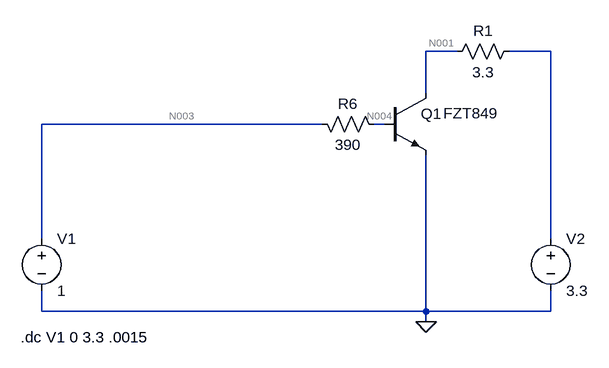
[diagram p0: schematic PLR5010D-Spice.asc]
PLR5010D-Spice.asc, the LTspice schematic file:
Version 4
SHEET 1 1044 680
WIRE 320 -160 272 -160
WIRE 464 -160 400 -160
WIRE 272 -96 272 -160
WIRE 112 -48 -320 -48
WIRE 208 -48 192 -48
WIRE -320 128 -320 -48
WIRE 464 128 464 -160
WIRE -320 240 -320 208
WIRE 272 240 272 0
WIRE 272 240 -320 240
WIRE 464 240 464 208
WIRE 464 240 272 240
WIRE 272 256 272 240
FLAG 272 256 0
SYMBOL voltage 464 112 R0
WINDOW 123 0 0 Left 2
WINDOW 39 0 0 Left 2
SYMATTR InstName V2
SYMATTR Value 3.3
SYMBOL res 416 -176 R90
WINDOW 0 0 56 VBottom 2
WINDOW 3 32 56 VTop 2
SYMATTR InstName R1
SYMATTR Value 3.3
SYMBOL npn 208 -96 R0
WINDOW 3 91 31 Left 2
SYMATTR Value FZT849
SYMATTR InstName Q1
SYMBOL voltage -320 112 R0
WINDOW 123 0 0 Left 2
WINDOW 39 0 0 Left 2
SYMATTR InstName V1
SYMATTR Value 1
SYMBOL res 96 -64 M90
WINDOW 0 0 56 VBottom 2
WINDOW 3 32 56 VTop 2
SYMATTR InstName R6
SYMATTR Value 390
TEXT -352 280 Left 2 !.dc V1 0 3.3 .0015

The netlist it stands for:
* PLR5010D-Spice.asc
V2 N002 0 3.3
R1 N002 N001 3.3
Q1 N001 N004 0 0 FZT849
V1 N003 0 1
R6 N003 N004 390
.model NPN NPN
.model PNP PNP
.lib standard.bjt
.dc V1 0 3.3 .0015
.backanno
.end

* Results of the author's LTspice run, read from the files saved beside the schematic
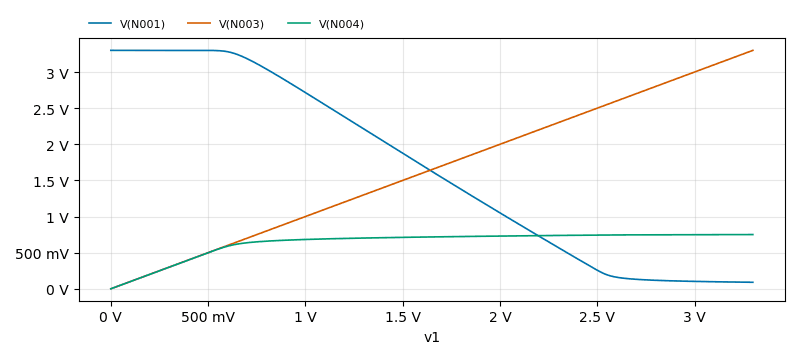
[diagram p1: DC transfer characteristic of PLR5010D-Spice.asc, plotted from the saved traces]
* DC transfer characteristic, 1 run:
*   V(N001): 3.3 V at v1=0 V, 90.23 mV at v1=3.3 V, min 90.23 mV, max 3.3 V
*   V(N003): 0 V at v1=0 V, 3.3 V at v1=3.3 V, min 0 V, max 3.3 V
*   V(N004): 1.495 nV at v1=0 V, 750.6 mV at v1=3.3 V, min 1.495 nV, max 750.6 mV